# EAGLE design ElectroMagnet_Rev2 (EAGLE 9.2.2)
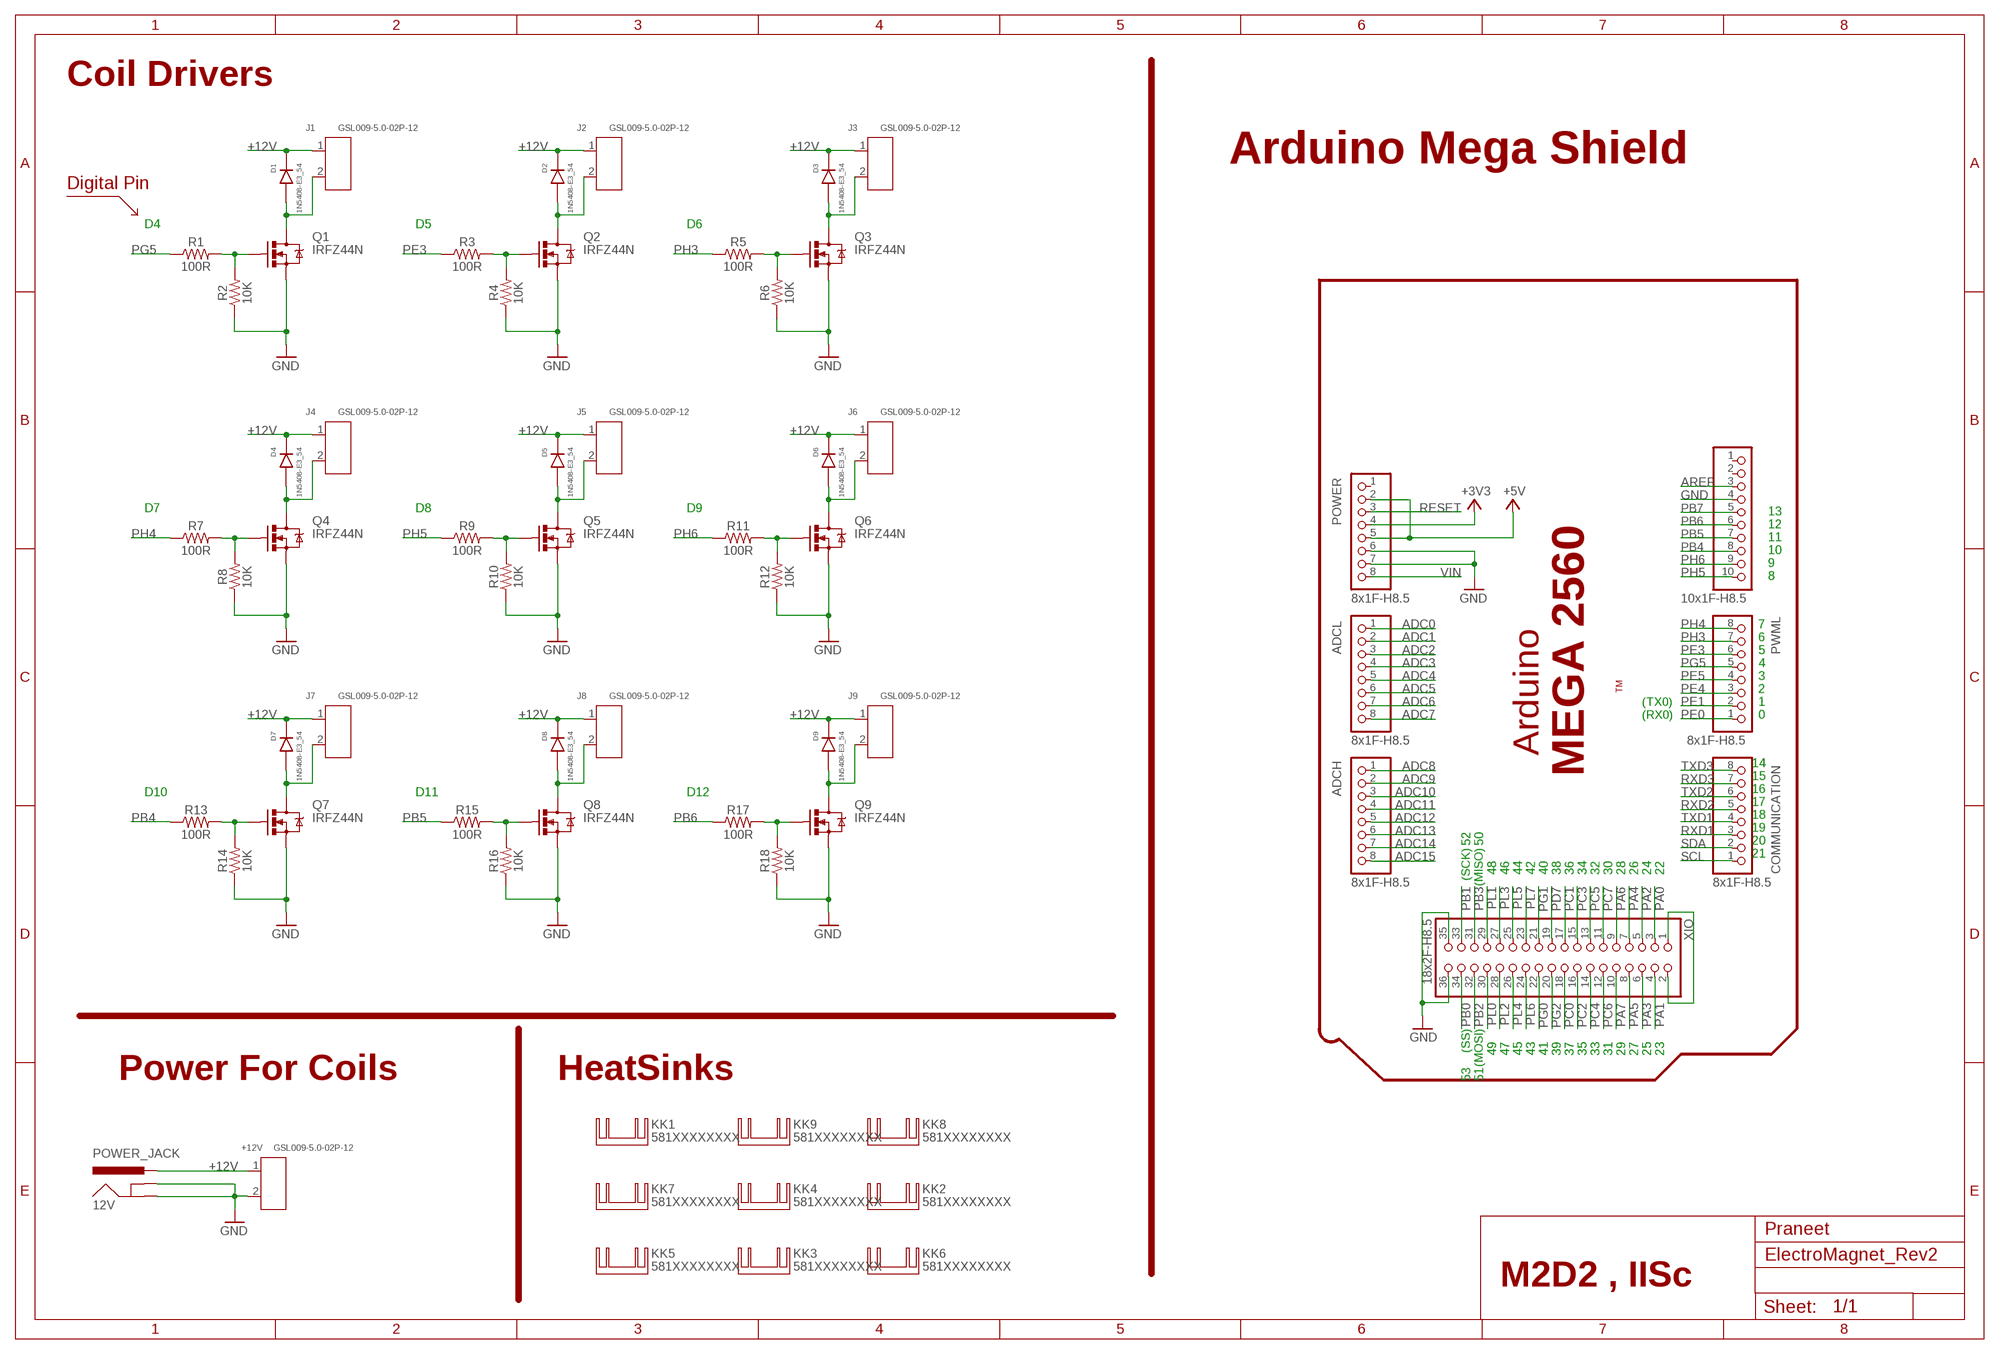
[diagram p0: schematic, sheet 1]

## Parts
12V  POWER_JACK  [POWER_JACK_PTH]
+12V  GSL009-5.0-02P-12  SCREW-TERMINAL-BLUE(2P-5.0)  [H2-5.0-10.5X8.0MM]
ADCH  8x1F-H8.5  PINHD-1X8  [1X08]
ADCL  8x1F-H8.5  PINHD-1X8  [1X08]
COMMUNICATION  8x1F-H8.5  PINHD-1X8  [1X08]
D1  1N5408-E3_54  [DIOAD2855W132L835D505]
D2  1N5408-E3_54  [DIOAD2855W132L835D505]
D3  1N5408-E3_54  [DIOAD2855W132L835D505]
D4  1N5408-E3_54  [DIOAD2855W132L835D505]
D5  1N5408-E3_54  [DIOAD2855W132L835D505]
D6  1N5408-E3_54  [DIOAD2855W132L835D505]
D7  1N5408-E3_54  [DIOAD2855W132L835D505]
D8  1N5408-E3_54  [DIOAD2855W132L835D505]
D9  1N5408-E3_54  [DIOAD2855W132L835D505]
J1  GSL009-5.0-02P-12  SCREW-TERMINAL-BLUE(2P-5.0)  [H2-5.0-10.5X8.0MM]
J2  GSL009-5.0-02P-12  SCREW-TERMINAL-BLUE(2P-5.0)  [H2-5.0-10.5X8.0MM]
J3  GSL009-5.0-02P-12  SCREW-TERMINAL-BLUE(2P-5.0)  [H2-5.0-10.5X8.0MM]
J4  GSL009-5.0-02P-12  SCREW-TERMINAL-BLUE(2P-5.0)  [H2-5.0-10.5X8.0MM]
J5  GSL009-5.0-02P-12  SCREW-TERMINAL-BLUE(2P-5.0)  [H2-5.0-10.5X8.0MM]
J6  GSL009-5.0-02P-12  SCREW-TERMINAL-BLUE(2P-5.0)  [H2-5.0-10.5X8.0MM]
J7  GSL009-5.0-02P-12  SCREW-TERMINAL-BLUE(2P-5.0)  [H2-5.0-10.5X8.0MM]
J8  GSL009-5.0-02P-12  SCREW-TERMINAL-BLUE(2P-5.0)  [H2-5.0-10.5X8.0MM]
J9  GSL009-5.0-02P-12  SCREW-TERMINAL-BLUE(2P-5.0)  [H2-5.0-10.5X8.0MM]
JP6  10x1F-H8.5  PINHD-1X10_ARD  [1X10]
KK1  581XXXXXXXX  [581XXXXXXXX]
KK2  581XXXXXXXX  [581XXXXXXXX]
KK3  581XXXXXXXX  [581XXXXXXXX]
KK4  581XXXXXXXX  [581XXXXXXXX]
KK5  581XXXXXXXX  [581XXXXXXXX]
KK6  581XXXXXXXX  [581XXXXXXXX]
KK7  581XXXXXXXX  [581XXXXXXXX]
KK8  581XXXXXXXX  [581XXXXXXXX]
KK9  581XXXXXXXX  [581XXXXXXXX]
POWER  8x1F-H8.5  PINHD-1X8  [1X08]
PWML  8x1F-H8.5  PINHD-1X8  [1X08]
Q1  IRFZ44N  [TO-220]
Q2  IRFZ44N  [TO-220]
Q3  IRFZ44N  [TO-220]
Q4  IRFZ44N  [TO-220]
Q5  IRFZ44N  [TO-220]
Q6  IRFZ44N  [TO-220]
Q7  IRFZ44N  [TO-220]
Q8  IRFZ44N  [TO-220]
Q9  IRFZ44N  [TO-220]
R1  100R  RESISTORAXIAL-0.3  [AXIAL-0.3]
R2  10K  RESISTORAXIAL-0.3  [AXIAL-0.3]
R3  100R  RESISTORAXIAL-0.3  [AXIAL-0.3]
R4  10K  RESISTORAXIAL-0.3  [AXIAL-0.3]
R5  100R  RESISTORAXIAL-0.3  [AXIAL-0.3]
R6  10K  RESISTORAXIAL-0.3  [AXIAL-0.3]
R7  100R  RESISTORAXIAL-0.3  [AXIAL-0.3]
R8  10K  RESISTORAXIAL-0.3  [AXIAL-0.3]
R9  100R  RESISTORAXIAL-0.3  [AXIAL-0.3]
R10  10K  RESISTORAXIAL-0.3  [AXIAL-0.3]
R11  100R  RESISTORAXIAL-0.3  [AXIAL-0.3]
R12  10K  RESISTORAXIAL-0.3  [AXIAL-0.3]
R13  100R  RESISTORAXIAL-0.3  [AXIAL-0.3]
R14  10K  RESISTORAXIAL-0.3  [AXIAL-0.3]
R15  100R  RESISTORAXIAL-0.3  [AXIAL-0.3]
R16  10K  RESISTORAXIAL-0.3  [AXIAL-0.3]
R17  100R  RESISTORAXIAL-0.3  [AXIAL-0.3]
R18  10K  RESISTORAXIAL-0.3  [AXIAL-0.3]
XIO  18x2F-H8.5  PINHD-2X18  [2X18]

## Nets
+3V3: POWER.4
+5V [power usb]: POWER.2 POWER.5
+12V: 12V.PWR +12V.1 D1.1(K) D2.1(K) D3.1(K) D4.1(K) D5.1(K) D6.1(K) D7.1(K) D8.1(K) D9.1(K) J1.1 J2.1 J3.1 J4.1 J5.1 J6.1 J7.1 J8.1 J9.1
ADC0: ADCL.1
ADC1: ADCL.2
ADC2: ADCL.3
ADC3: ADCL.4
ADC4: ADCL.5
ADC5: ADCL.6
ADC6: ADCL.7
ADC7: ADCL.8
ADC8: ADCH.1
ADC9: ADCH.2
ADC10: ADCH.3
ADC11: ADCH.4
ADC12: ADCH.5
ADC13: ADCH.6
ADC14: ADCH.7
ADC15: ADCH.8
AREF: JP6.3
GND [gnd]: 12V.GND 12V.GNDBREAK +12V.2 JP6.4 POWER.6 POWER.7 Q1.3(S) Q2.3(S) Q3.3(S) Q4.3(S) Q5.3(S) Q6.3(S) Q7.3(S) Q8.3(S) Q9.3(S) R2.P$1 R4.P$1 R6.P$1 R8.P$1 R10.P$1 R12.P$1 R14.P$1 R16.P$1 R18.P$1 XIO.35 XIO.36
N$1 [power usb]: XIO.1 XIO.2
N$2: D1.2(A) J1.2 Q1.2(D)
N$4: Q1.1(G) R1.P$2 R2.P$2
N$6: D2.2(A) J2.2 Q2.2(D)
N$7: Q2.1(G) R3.P$2 R4.P$2
N$10: D3.2(A) J3.2 Q3.2(D)
N$11: Q3.1(G) R5.P$2 R6.P$2
N$14: D4.2(A) J4.2 Q4.2(D)
N$15: Q4.1(G) R7.P$2 R8.P$2
N$18: D5.2(A) J5.2 Q5.2(D)
N$19: Q5.1(G) R9.P$2 R10.P$2
N$22: D6.2(A) J6.2 Q6.2(D)
N$23: Q6.1(G) R11.P$2 R12.P$2
N$26: D7.2(A) J7.2 Q7.2(D)
N$27: Q7.1(G) R13.P$2 R14.P$2
N$30: D8.2(A) J8.2 Q8.2(D)
N$31: Q8.1(G) R15.P$2 R16.P$2
N$34: D9.2(A) J9.2 Q9.2(D)
N$35: Q9.1(G) R17.P$2 R18.P$2
PA0: XIO.3
PA1: XIO.4
PA2: XIO.5
PA3: XIO.6
PA4: XIO.7
PA5: XIO.8
PA6: XIO.9
PA7: XIO.10
PB0: XIO.34
PB1: XIO.33
PB2: XIO.32
PB3: XIO.31
PB4: JP6.8 R13.P$1
PB5: JP6.7 R15.P$1
PB6: JP6.6 R17.P$1
PB7: JP6.5
PC0: XIO.18
PC1: XIO.17
PC2: XIO.16
PC3: XIO.15
PC4: XIO.14
PC5: XIO.13
PC6: XIO.12
PC7: XIO.11
PD7: XIO.19
PE0: PWML.1
PE1: PWML.2
PE3: PWML.6 R3.P$1
PE4: PWML.3
PE5: PWML.4
PG0: XIO.22
PG1: XIO.21
PG2: XIO.20
PG5: PWML.5 R1.P$1
PH3: PWML.7 R5.P$1
PH4: PWML.8 R7.P$1
PH5: JP6.10 R9.P$1
PH6: JP6.9 R11.P$1
PL0: XIO.30
PL1: XIO.29
PL2: XIO.28
PL3: XIO.27
PL4: XIO.26
PL5: XIO.25
PL6: XIO.24
PL7: XIO.23
RESET: POWER.3
RXD1: COMMUNICATION.3
RXD2: COMMUNICATION.5
RXD3: COMMUNICATION.7
SCL: COMMUNICATION.1
SDA: COMMUNICATION.2
TXD1: COMMUNICATION.4
TXD2: COMMUNICATION.6
TXD3: COMMUNICATION.8
VIN [power]: POWER.8
Unconnected: JP6.1 JP6.2 POWER.1

## Notes on the sheet
- Coil Drivers
- Arduino Mega Shield
- Digital Pin
- D4 | D5 | D6
- D7 | D8 | D9 | 13
- MEGA 2560 | 12
- 11
- 10
- 9
- 8
- Arduino | 7
- 6
- 5
- 4
- TM | 3
- 2
- (TX0) | 1
- (RX0) | 0
- 14
- 15
- D10 | D11 | D12 | 16
- 17
- 18
- 52 | 50 | 19
- (SCK) | (MISO) | 20
- 48 | 46 | 44 | 42 | 40 | 38 | 36 | 34 | 32 | 30 | 28 | 26 | 24 | 22 | 21
- (SS) | (MOSI)
- 49 | 47 | 45 | 43 | 41 | 39 | 37 | 35 | 33 | 31 | 29 | 27 | 25 | 23
- 53 | 51
- Power For Coils | HeatSinks
- Praneet
- M2D2 , IISc

## Library data of the parts
12V = SparkFun-Connectors:POWER_JACK: Power Jack Connector This is the standard 5.5mm barrel jack for power. The PTH is the most common, proven, reliable, footprint. The Slot footprint only works if the mill layer is transmitted to the PCB fab house so be warned. Here are the connectors we sell at SparkFun: DC Barrel Power Jack/Connector <https://www.sparkfun.com/products/119> (PRT-00119) DC Barrel Power Jack/Connector (SMD) <https://www.sparkfun.com/products/12748> (PRT-12748) DC Barrel Jack Adapter - Breadboard Compatible <https://www.sparkfun.com/products/10811> (PRT-10811) It is used on this SparkFun product (and many, many others): SparkFun RedBoard - Programmed with Arduino <https://www.sparkfun.com/products/12757> (DEV-12757) Also, if you need a mating power supply or connector, please check these out: Wall Adapter Power Supply - 9VDC 650mA <https://www.sparkfun.com/products/298> (TOL-00298) DC Barrel Jack Adapter - Male <https://www.sparkfun.com/products/10287> (PRT-10287); PROD_ID: CONN-08197
+12V J1-J9 = Ei:SCREW-TERMINAL-BLUE(2P-5.0): 320120007; MPN: GSL009-5.0-02P-12
ADCH ADCL COMMUNICATION POWER PWML = SmartPrj:PINHD-1X8: PIN HEADER
D1-D9 = Ei:1N5408-E3_54: Rectifier Diode 3A 1000V 1.2Vf DO-201AD Vishay 1N5408-E3/54, Diode, 1000V 3A, 2-Pin DO-201AD Source: Datasheet <https://www.vishay.com/docs/88516/1n5400.pdf>; ALLIED_NUMBER: 70217545; ALLIED_PRICE-STOCK: https://www.alliedelec.com/general-semiconductor-vishay-1n5408-e3-54/70217545/; DESCRIPTION: Rectifier Diode 3A 1000V 1.2Vf DO-201AD Vishay 1N5408-E3/54, Diode, 1000V 3A, 2-Pin DO-201AD; HEIGHT: mm; MANUFACTURER_NAME: Vishay; MANUFACTURER_PART_NUMBER: 1N5408-E3/54; MOUSER_PART_NUMBER: 625-1N5408-E3; MOUSER_PRICE-STOCK: https://www.mouser.com/Search/Refine.aspx?Keyword=625-1N5408-E3; RS_PART_NUMBER: 6289502P; RS_PRICE-STOCK: http://uk.rs-online.com/web/p/products/6289502P
JP6 = SmartPrj:PINHD-1X10_ARD: PIN HEADER
KK1-KK9 = Ei:581XXXXXXXX: HEATSINK TO-220/218
Q1-Q9 = Ei:IRFZ44N; AVAILABILITY: Unavailable; DESCRIPTION: Transistor NPN Field Effect IRFZ44/IRFZ44N INTERNATIONAL RECTIFIER Ampere=46 V=250 TO220; MF: International Rectifier; MP: IRFZ44N; PACKAGE: TO-220 International Rectifier; PRICE: None
R1-R18 = SparkFun-Resistors:RESISTOR: Generic Resistor Package
XIO = SmartPrj:PINHD-2X18: PIN HEADER

## Net classes
0 default: width 0.203 mm, drill 0.406 mm, clearance 0.203 mm
1 power: width 0.61 mm, drill 0.406 mm, clearance 0.203 mm
2 gnd: width 0.305 mm, drill 0.406 mm, clearance 0.203 mm
3 power usb: width 0.508 mm, drill 0.406 mm, clearance 0.203 mm

## Board
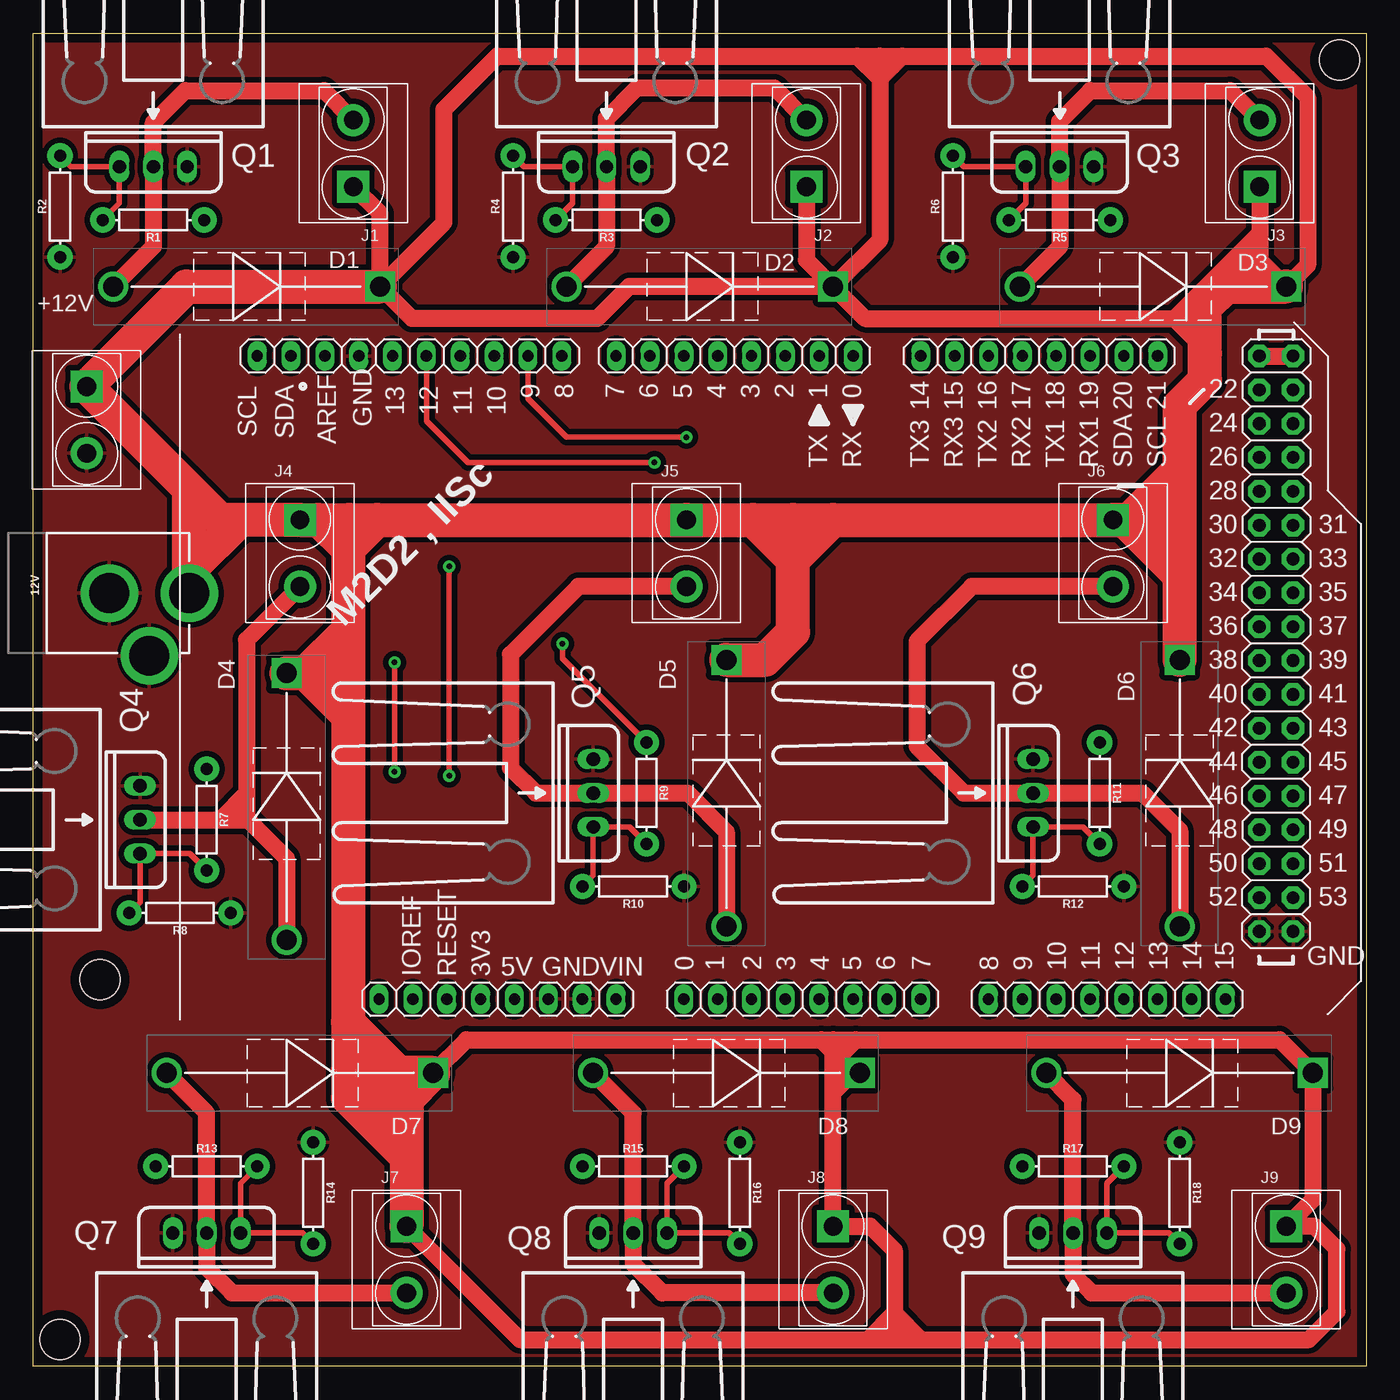
[diagram p1: board, top side]
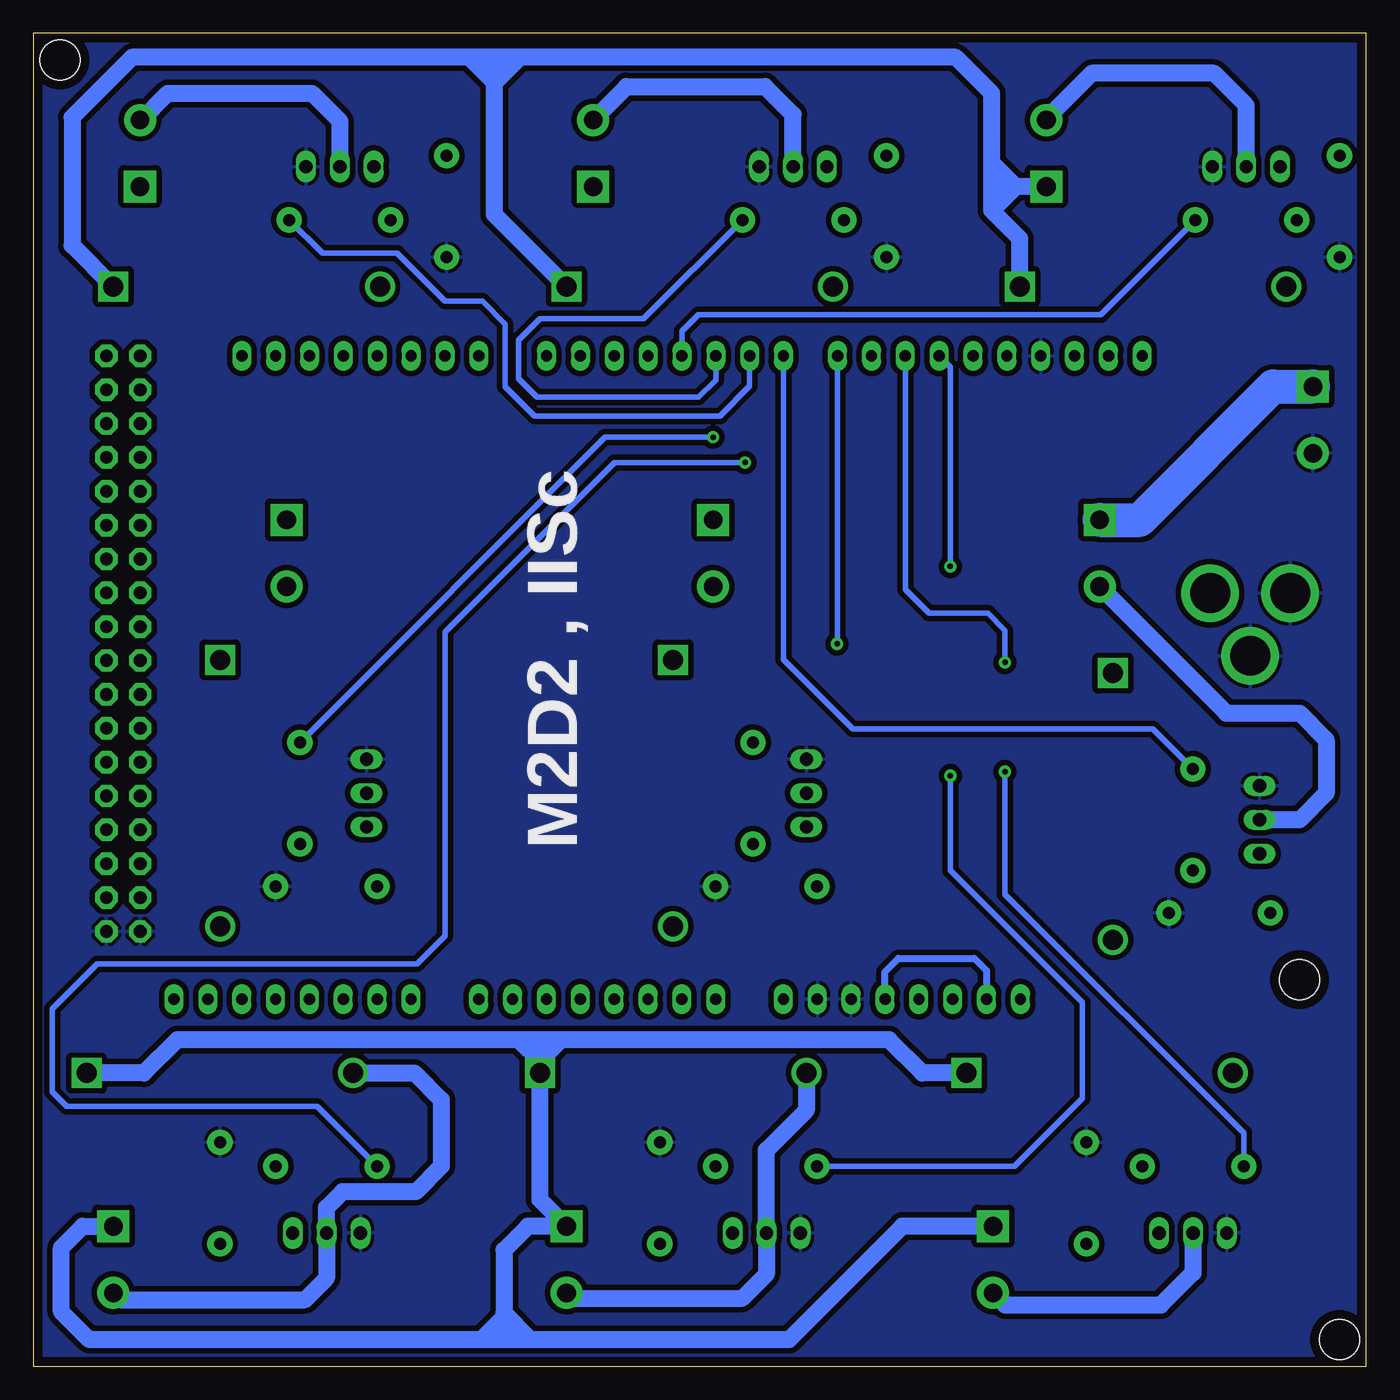
[diagram p2: board, bottom side, seen from below]

Size 100 x 100 mm. Coordinates in mm from the lower left corner, seen from the top.
Outline: 0,0 0,100 100,100 100,0 0,0
Copper layers (1*16): Top 0.035mm / dielectric 1.5mm / Bottom 0.035mm
Design rules "default": minimum track width 8mil, minimum drill 16mil, track to track 7mil, track to pad 7mil, pad to pad 8mil, via to via 10mil, smd to smd 7mil, copper to edge 27mil, drill to drill 12mil, minimum pad ring 10mil, minimum via ring 10mil, stop-mask expansion 2mil, vias tented up to drill 24mil, thermal gap 10mil
Holes 3 mm at 98,98 2,2 5,29

### Footprints (pad centres in the part's own frame; a part is rotated, then mirrored left to right if it is on the bottom)
POWER_JACK_PTH = drill 2.997 pad 4.318: GND 0,7.7; GNDBREAK 4.7,10.7; PWR 0,13.7
H2-5.0-10.5X8.0MM = drill 1.4 pad 2.4 square: 1 0,2.5 | drill 1.4 pad 2.4: 2 0,-2.5
1X08 = drill 0.85 pad 1.422 long: 1 -8.89,0; 2 -6.35,0; 3 -3.81,0; 4 -1.27,0; 5 1.27,0; 6 3.81,0; 7 6.35,0; 8 8.89,0
DIOAD2855W132L835D505 = drill 1.5 pad 2.25 square: 1 0,0 | drill 1.5 pad 2.25: 2 20,0
1X10 = drill 0.85 pad 1.422 long: 1 -11.43,0; 2 -8.89,0; 3 -6.35,0; 4 -3.81,0; 5 -1.27,0; 6 1.27,0; 7 3.81,0; 8 6.35,0; 9 8.89,0; 10 11.43,0
TO-220 = drill 1 long: 1 -2.54,0; 2 0,0; 3 2.54,0
AXIAL-0.3 = drill 0.9 pad 1.88: P$1 -3.81,0; P$2 3.81,0
2X18 = drill 0.95 pad 1.676 octagon: 1 -21.59,-1.27; 2 -21.59,1.27; 3 -19.05,-1.27; 4 -19.05,1.27; 5 -16.51,-1.27; 6 -16.51,1.27; 7 -13.97,-1.27; 8 -13.97,1.27; 9 -11.43,-1.27; 10 -11.43,1.27; 11 -8.89,-1.27; 12 -8.89,1.27; 13 -6.35,-1.27; 14 -6.35,1.27; 15 -3.81,-1.27; 16 -3.81,1.27; 17 -1.27,-1.27; 18 -1.27,1.27; 19 1.27,-1.27; 20 1.27,1.27; 21 3.81,-1.27; 22 3.81,1.27; 23 6.35,-1.27; 24 6.35,1.27; 25 8.89,-1.27; 26 8.89,1.27; 27 11.43,-1.27; 28 11.43,1.27; 29 13.97,-1.27; 30 13.97,1.27; 31 16.51,-1.27; 32 16.51,1.27; 33 19.05,-1.27; 34 19.05,1.27; 35 21.59,-1.27; 36 21.59,1.27

### Placement (x,y rotation side)
12V  -2,58 270 top
+12V  4,71 0 top
ADCH  80.55,27.54 0 top
ADCL  57.69,27.54 0 top
COMMUNICATION  75.47,75.8 180 top
D1  26,81 180 top
D2  60,81 180 top
D3  94,81 180 top
D4  19,52 270 top
D5  52,53 270 top
D6  86,53 270 top
D7  30,22 180 top
D8  62,22 180 top
D9  96,22 180 top
J1  24,91 180 top
J2  58,91 180 top
J3  92,91 180 top
J4  20,61 0 top
J5  49,61 0 top
J6  81,61 0 top
J7  28,8 0 top
J8  60,8 0 top
J9  94,8 0 top
JP6  28.23,75.8 0 top
KK1  9,93 0 top
KK2  43,93 0 top
KK3  77,93 0 top
KK4  5,41 90 top
KK5  39,43 90 top
KK6  72,43 90 top
KK7  13,7 180 top
KK8  45,7 180 top
KK9  78,7 180 top
POWER  34.83,27.54 0 top
PWML  52.61,75.8 180 top
Q1  9,90 0 top
Q2  43,90 0 top
Q3  77,90 0 top
Q4  8,41 90 top
Q5  42,43 90 top
Q6  75,43 90 top
Q7  13,10 180 top
Q8  45,10 180 top
Q9  78,10 180 top
R1  9,86 180 top
R2  2,87 90 top
R3  43,86 180 top
R4  36,87 90 top
R5  77,86 180 top
R6  69,87 90 top
R7  13,41 270 top
R8  11,34 180 top
R9  46,43 270 top
R10  45,36 180 top
R11  80,43 270 top
R12  78,36 180 top
R13  13,15 0 top
R14  21,13 270 top
R15  45,15 0 top
R16  53,13 270 top
R17  78,15 0 top
R18  86,13 270 top
XIO  93.25,54.21 270 top

### Tracks (layer width: path | path; a pad name or v marks a point on that pad's centre or on a via)
+5V
  Bottom 0.508: POWER.5 36.1,29.6 35.1,30.6 29.4,30.6 28.48,29.68 POWER.2
+12V
  Top 1.27: J2.1 58,83 D2.1 | J3.1 92,85 | 92,85 92,83 D3.1 | D1.1 28.4,78.6 42.3,78.6 44.7,81 D2.1 | D1.1 30.8,85.8 30.8,94.3 34.8,98.3 61.8,98.3 | 63.5,98.3 63.5,96.6 | 63.5,96.6 63.5,84.5 D2.1 | 61.8,98.3 63.5,98.3 | 63.5,98.3 65.2,98.3 | 65.2,98.3 92.5,98.3 95.6,95.2 95.6,82.6 D3.1 | D2.1 62.4,78.6 85.6,78.6 | 89.5,81 87.1,78.6 85.6,78.6 | D7.1 32.5,24.5 59.1,24.5 | 59.1,24.5 60,24.5 | J7.1 36.5,2 62.6,2 | 62.6,2 64.6,2 | 64.6,2 66.6,2 | 66.6,2 95.7,2 97.8,4.1 97.8,8.8 96.1,10.5 J9.1 96,12.5 D9.1 93.5,24.5 61.7,24.5 | 64.6,4 64.6,8.7 62.8,10.5 J8.1 60,20.5 | 64.6,4 64.6,2 | 62.6,2 64.6,4 | 64.6,4 66.6,2 | D1.1 26,86.5 J1.1 | 65.2,98.3 63.5,96.6 | 63.5,96.6 61.8,98.3 | 60,20.5 60,22.1 | 60,22.1 60,23.6 | 60,23.6 60,24.5 | D8.1 60.1,22 60,22.1 | D8.1 61.6,22 60,23.6 | D8.1 61.5,22 60,20.5 | 60,24.5 61.7,24.5 | 61.7,24.5 60.8,23.6 60,23.6 | 60,23.6 59.1,24.5 | 85.6,78.6 87.9,76.3 87.9,76 | 85.6,78.6 89.3,82.3 | 89.3,82.3 91.6,82.3 | 91.6,82.3 92.9,81 D3.1 | 89.3,82.3 91.25,84.25 | 91.25,84.25 92,85 | 91.25,84.25 91.3,84.2 91.3,82.6 91.6,82.3
  Top 2.54: J4.1 21.4,63.5 | 21.4,63.5 23.7,63.5 | 23.7,63.5 25.8,63.5 | 25.8,63.5 J5.1 54,63.5 | 54,63.5 57,63.5 | 57,63.5 60,63.5 | 60,63.5 J6.1 | 23.7,63.5 23.6,63.4 23.6,61.3 | D5.1 54.9,53 57,55.1 57,60.5 | 57,60.5 57,63.5 | D6.1 86,59.3 | 86,59.3 86,61.8 | 86,61.8 84.3,63.5 J6.1 | 86,61.8 86,67.3 | 86,67.3 86,72.1 87.9,74 87.9,76 87.9,79.4 89.5,81 D3.1 | D1.1 11.5,81 +12V.1 11.7,65.8 | 28,15.7 J7.1 | 23.6,61.3 23.6,55.2 | 23.6,55.2 23.6,52.1 | 23.6,52.1 23.6,48.8 | 23.6,48.8 23.6,25.8 | 23.6,25.8 23.6,22.2 | 23.6,22.2 23.6,20.1 25.7,18 | 25.7,18 28,15.7 | D4.1 20.4,52 | 20.4,52 23.5,52 23.6,52.1 | 20.4,52 23.6,55.2 | 20.4,52 23.6,48.8 | 54,63.5 57,60.5 | 57,60.5 60,63.5 | 86,67.3 82.2,63.5 J6.1 | J6.1 81.8,63.5 86,59.3 | 25.6,22 D7.1 28,20 28,15.7 | 25.6,22 23.8,22 23.6,22.2 | 25.6,22 25.6,20.1 26.5,19.2 27.2,19.9 | 27.2,19.9 27.2,21.4 27.3,21.3 27.7,21.3 26.5,20.1 25.7,20.1 25.7,18 | 23.6,25.8 28.1,21.3 28.2,21.3 28.2,20.9 27.2,19.9 | J4.1 14,63.5 11.7,65.8 | 21.4,63.5 23.6,61.3 | 23.6,61.3 25.8,63.5 | J4.1 15.5,63.5 11.7,59.7 12V.PWR 11.7,65.8
  Bottom 1.27: J7.1 34.8,10.5 43.3,2 62.7,2 | J9.1 96.3,10.5 97.9,8.9 97.9,4.1 95.8,2 66.4,2 | 62.7,2 64.3,2 | 64.3,2 66.4,2 | 64.7,4 64.7,8.7 62.9,10.5 J8.1 62,12.5 D8.1 62,22.9 | 64.7,3.7 64.7,2.4 64.3,2 | 62.7,2 64.7,4 | 64.7,4 64.7,3.7 | 64.7,3.7 66.4,2 | D1.1 26,84.6 28.1,86.7 | 28.1,86.7 28.1,88.7 | 28.1,88.7 28.1,90.2 | 28.1,90.2 28.1,95.5 30.8,98.2 63.5,98.2 | 63.5,98.2 65.4,98.2 | 65.4,98.2 67.3,98.2 | 67.3,98.2 92.6,98.2 97.1,93.7 97.1,84.1 D3.1 | 28.1,88.7 27.9,88.5 26.3,88.5 | J1.1 26.3,88.5 | 26.3,88.5 28,90.2 28.1,90.2 | 26.3,88.5 28.1,86.7 | D2.1 65.4,86.4 65.4,96.3 | 65.4,96.3 65.4,98.2 | 67.3,98.2 65.4,96.3 | 65.4,96.3 63.5,98.2 | D7.1 33.3,22 35.8,24.5 60.4,24.5 | D9.1 91.7,22 89.2,24.5 63.6,24.5 | 60.4,24.5 61.9,24.5 | 61.9,24.5 63.6,24.5 | 62,22.9 62,24.4 61.9,24.5 | 63.6,24.5 62,22.9 | 62,22.9 60.4,24.5
  Bottom 2.54: +12V.1 7,73.5 17,63.5 J4.1
GND
  pour Top (isolate 0.406): -1,-1 -1,101 2,101 101,101 101,96 101,-1
  pour Bottom (isolate 0.406): -2,-2 -2,102 1,102 102,102 102,94 102,-2
N$1
  Top 1.27: XIO.1 XIO.2
N$2
  Top 1.27: J1.2 21.8,95.7 11.4,95.7 9,93.3 Q1.2 9,84 D1.2
  Bottom 1.27: Q1.2 9,94.6 11.4,97 20.6,97 24,93.6 J1.2
N$4
  Top 0.406: R2.P$2 2.81,90 Q1.1 6.46,87.27 R1.P$2
N$6
  Top 1.27: J2.2 55.6,95.9 45.3,95.9 43,93.6 Q2.2 43,84 D2.2
  Bottom 1.27: Q2.2 43,93.9 45.1,96 55.5,96 J2.2
N$7
  Top 0.406: R4.P$2 36.81,90 Q2.1 40.46,87.27 R3.P$2
N$10
  Top 1.27: J3.2 89.8,95.7 79.3,95.7 77,93.4 Q3.2 77,84 D3.2
  Bottom 1.27: Q3.2 77,93.4 79.1,95.5 89.9,95.5 91.9,93.5 J3.2
N$11
  Top 0.406: R6.P$2 69.81,90 Q3.1 74.46,87.27 R5.P$2
N$14
  Top 1.27: Q4.2 14,41 | 14,41 16.1,41 | 16.1,41 19,38.1 D4.2 | J4.2 16,54.5 16,43 | 16.1,41 16,41.1 16,43 | 16,43 14,41
  Bottom 1.27: J4.2 10.5,49 5,49 3,47 3,43 5,41 Q4.2
N$15
  Top 0.406: R8.P$2 8,34.81 Q4.1 11.73,38.46 R7.P$2
N$18
  Top 1.27: J5.2 40.9,58.5 35.8,53.4 35.8,44.9 37.7,43 Q5.2 49.1,43 52,40.1 D5.2
N$19
  Top 0.406: R10.P$2 42,36.81 Q5.1 44.73,40.46 R9.P$2
N$22
  Top 1.27: J6.2 70.4,58.5 66.3,54.4 66.3,46.5 69.8,43 Q6.2 83.2,43 86,40.2 D6.2
N$23
  Top 0.406: R11.P$2 78.73,40.46 Q6.1 75,36.81 R12.P$2
N$26
  Top 1.27: J7.2 14.9,5.5 13,7.4 Q7.2 13,19 D7.2
  Bottom 1.27: Q7.2 13,7 15.4,4.6 27.1,4.6 J7.2
N$27
  Top 0.406: R13.P$2 15.54,13.73 Q7.1 20.19,10 R14.P$2
N$30
  Top 1.27: J8.2 47.2,5.5 45,7.7 Q8.2 45,19 D8.2
  Bottom 1.27: J8.2 59.6,5.1 46.8,5.1 45,6.9 Q8.2 45,16.2 42,19.2 D8.2
N$31
  Top 0.406: R15.P$2 47.54,13.73 Q8.1 52.19,10 R16.P$2
N$34
  Top 1.27: J9.2 79.4,5.5 78,6.9 Q9.2 78,20 D9.2
  Bottom 1.27: J9.2 93.5,5 79.6,5 78,6.6 Q9.2 78,11.9 76.8,13.1 71.3,13.1 69.4,15 69.4,20 71.4,22 D9.2
N$35
  Top 0.406: R18.P$2 85.19,10 Q9.1 80.54,13.73 R17.P$2
PB4  (via drill 0.41)
  Top 0.406: v27.1,44.6 v27.1,52.8
  Bottom 0.406: R13.P$1 9.19,17.5 27.1,35.41 v27.1,44.6 | v27.1,52.8 27.1,55.2 28.4,56.5 32.8,56.5 34.58,58.28 JP6.8
PB5  (via drill 0.41)
  Top 0.406: v31.2,44.3 v31.2,60
  Bottom 0.406: v31.2,60 31.2,74.96 JP6.7 | R15.P$1 26.4,15 21.3,20.1 21.3,27.3 31.2,37.2 v31.2,44.3
PB6  (via drill 0.41)
  Top 0.406: v46.6,67.8 32.6,67.8 29.5,70.9 JP6.6
  Bottom 0.406: v46.6,67.8 56.4,67.8 69.1,55.1 69.1,32.3 71.2,30.2 95.2,30.2 98.6,26.8 98.6,20.6 97.5,19.5 78.69,19.5 R17.P$1
PE3
  Bottom 0.406: PWML.6 48.8,74 50.1,72.7 62.2,72.7 63.6,74.1 63.6,77 62,78.6 54.21,78.6 R3.P$1
PG5
  Bottom 0.406: PWML.5 51.34,77.66 50.1,78.9 19.9,78.9 R1.P$1
PH3
  Bottom 0.406: PWML.7 46.26,73.54 48.5,71.3 62.4,71.3 64.6,73.5 64.6,78.2 66.3,79.9 69.1,79.9 72.7,83.5 78.31,83.5 R5.P$1
PH4
  Bottom 0.406: PWML.8 43.72,53.02 38.5,47.8 15.99,47.8 R7.P$1
PH5  (via drill 0.41)
  Top 0.406: v39.7,54.2 39.7,53.11 R9.P$1
  Bottom 0.406: JP6.10 39.66,54.24 v39.7,54.2
PH6  (via drill 0.41)
  Top 0.406: v49,69.7 40,69.7 37.1,72.6 37.1,75.78 JP6.9
  Bottom 0.406: R11.P$1 57.11,69.7 v49,69.7

### Text on the board
tPlace: 9 | 8 | 7 | 6 | 5 | 4 | 3 | 2 | 1 | 0 | 22 | 14 | 15 | 16 | 17 | 18 | 19 | 20 | 21 | 13 | 12 | 11 | 10 | 24 | 26 | 28 | 30 | 31 | 32 | 33 | 34 | 35 | M2D2 , IISc | 36 | 37 | 38 | 39 | 40 | 41 | 42 | 43 | 44 | 45 | 46 | 47 | 48 | 49 | 50 | 51 | 52 | 53 | 0 | 1 | 2 | 3 | 4 | 5 | 6 | 7 | 8 | 9 | 10 | 11 | 12 | 13 | 14 | 15
bPlace: M2D2 , IISc
tNames: SCL | SDA | GND | AREF | TX | RX | TX3 | RX3 | TX2 | RX2 | TX1 | RX1 | SDA | SCL | GND | IOREF | RESET | 3V3 | 5V | GND | VIN